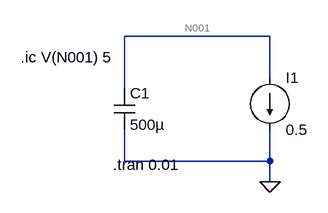
[diagram p0: schematic bypass_capacitor.asc]
bypass_capacitor.asc, the LTspice schematic file:
Version 4
SHEET 1 880 680
WIRE 256 64 32 64
WIRE 256 128 256 64
WIRE 32 144 32 64
WIRE 32 256 32 208
WIRE 256 256 256 208
WIRE 256 256 32 256
WIRE 256 288 256 256
FLAG 256 288 0
SYMBOL cap 16 144 R0
SYMATTR InstName C1
SYMATTR Value 500µ
SYMBOL current 256 128 R0
WINDOW 123 0 0 Left 0
WINDOW 39 0 0 Left 0
SYMATTR InstName I1
SYMATTR Value 0.5
TEXT 14 262 Left 2 !.tran 0.01
TEXT -128 96 Left 2 !.ic V(N001) 5

The netlist it stands for:
* bypass_capacitor.asc
C1 N001 0 500µ
I1 N001 0 0.5
.tran 0.01
.ic V(N001) 5
.backanno
.end